# Altium schematic sheet Sheet1.SchDoc
size A4
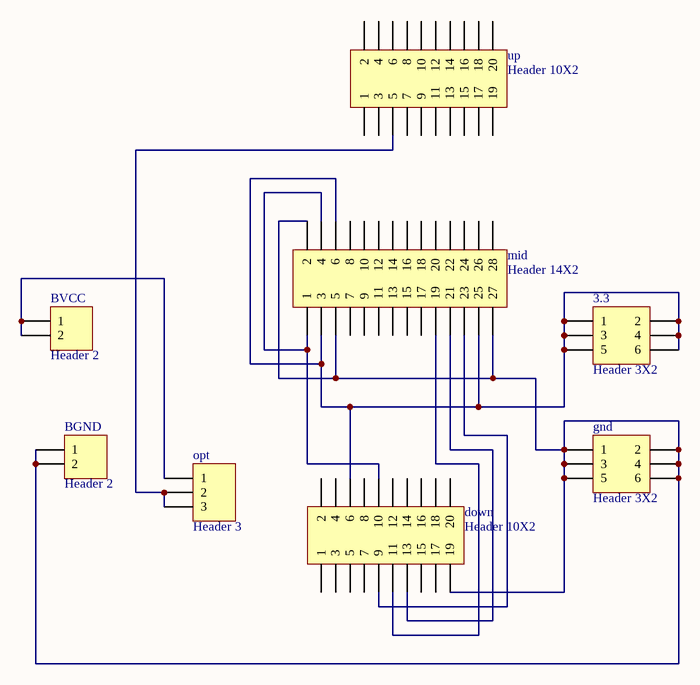
[diagram p0: Sheet1.SchDoc]

## Parts
3.3  Header 3X2  [HDR2X3]
BGND  Header 2  [HDR1X2]
BVCC  Header 2  [HDR1X2]
down  Header 10X2  [HDR2X10]
gnd  Header 3X2  [HDR2X3]
mid  Header 14X2  [HDR2X14]
opt  Header 3  [HDR1X3]
up  Header 10X2  [HDR2X10]

## Nets
Net3.3_1: 3.3.1 3.3.2 3.3.3 3.3.4 3.3.5 3.3.6 down.6 mid.3 mid.6 mid.25
NetBGND_1: BGND.1 BGND.2 down.19 gnd.1 gnd.2 gnd.3 gnd.4 gnd.5 gnd.6 mid.2 mid.5 mid.27
NetBVCC_1: BVCC.1 BVCC.2 opt.1
Netdown_9: down.9 mid.23
Netdown_10: down.10 mid.1 mid.4
Netdown_11: down.11 mid.19
Netdown_13: down.13 mid.21
Netopt_2: opt.2 opt.3 up.5

Not connected (* = marked no-connect by the designer): down 1 2 3 4 5 7 8 12 14 15 16 17 18 20; mid 7 8 9 10 11 12 13 14 15 16 17 18 20 22 24 26 28; up 1 2 3 4 6 7 8 9 10 11 12 13 14 15 16 17 18 19 20

## Library data of the parts
3.3 gnd = Header 3X2: Header, 3-Pin, Dual row; LatestRevisionDate: 17-Jul-2002; LatestRevisionNote: Re-released for DXP Platform.; Publisher: Altium Limited
BGND BVCC = Header 2: Header, 2-Pin; LatestRevisionDate: 17-Jul-2002; LatestRevisionNote: Re-released for DXP Platform.; Publisher: Altium Limited
down up = Header 10X2: Header, 10-Pin, Dual row; LatestRevisionDate: 17-Jul-2002; LatestRevisionNote: Re-released for DXP Platform.; Publisher: Altium Limited
mid = Header 14X2: Header, 14-Pin, Dual row; LatestRevisionDate: 17-Jul-2002; LatestRevisionNote: Re-released for DXP Platform.; Publisher: Altium Limited
opt = Header 3: Header, 3-Pin; LatestRevisionDate: 17-Jul-2002; LatestRevisionNote: Re-released for DXP Platform.; Publisher: Altium Limited